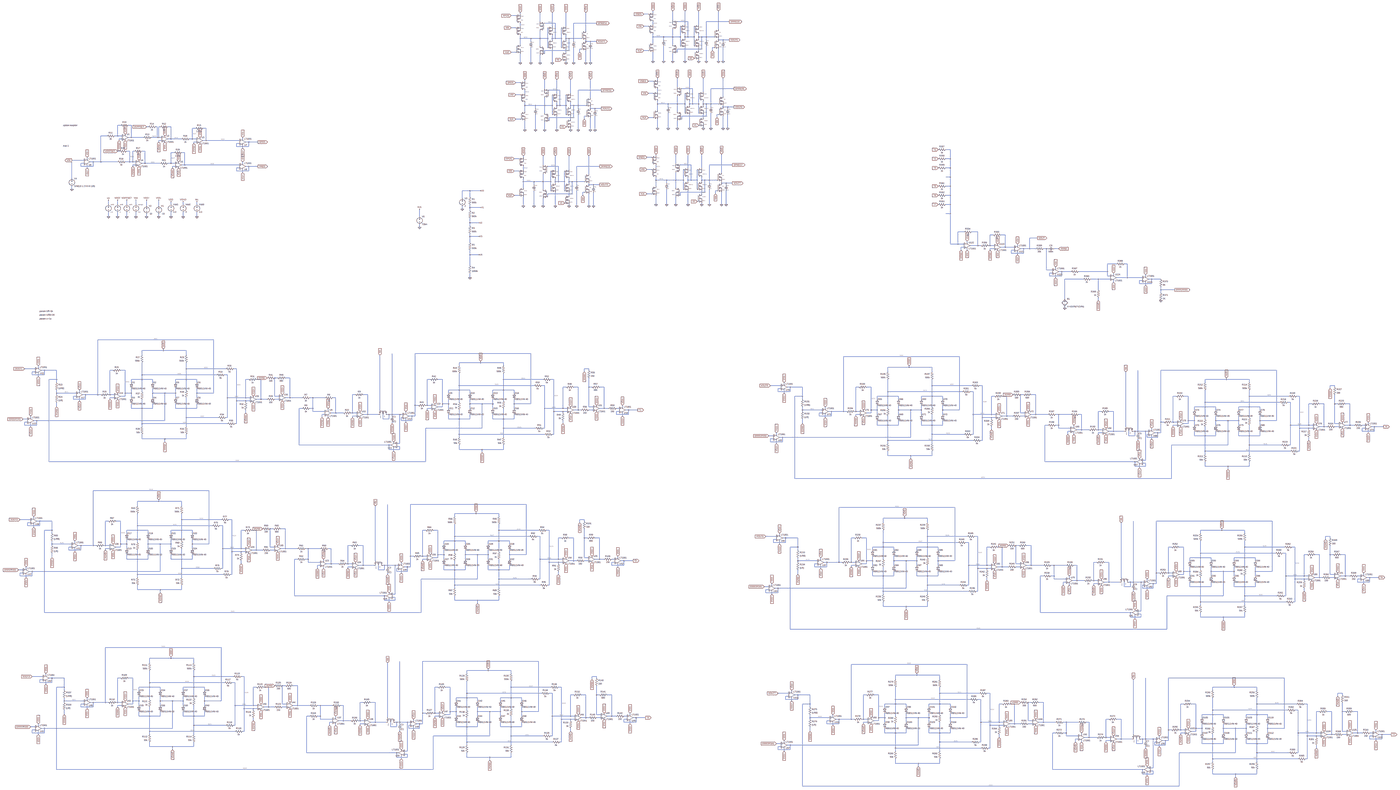
[diagram p0: schematic OZ_6_pure_curves.asc, whole sheet]
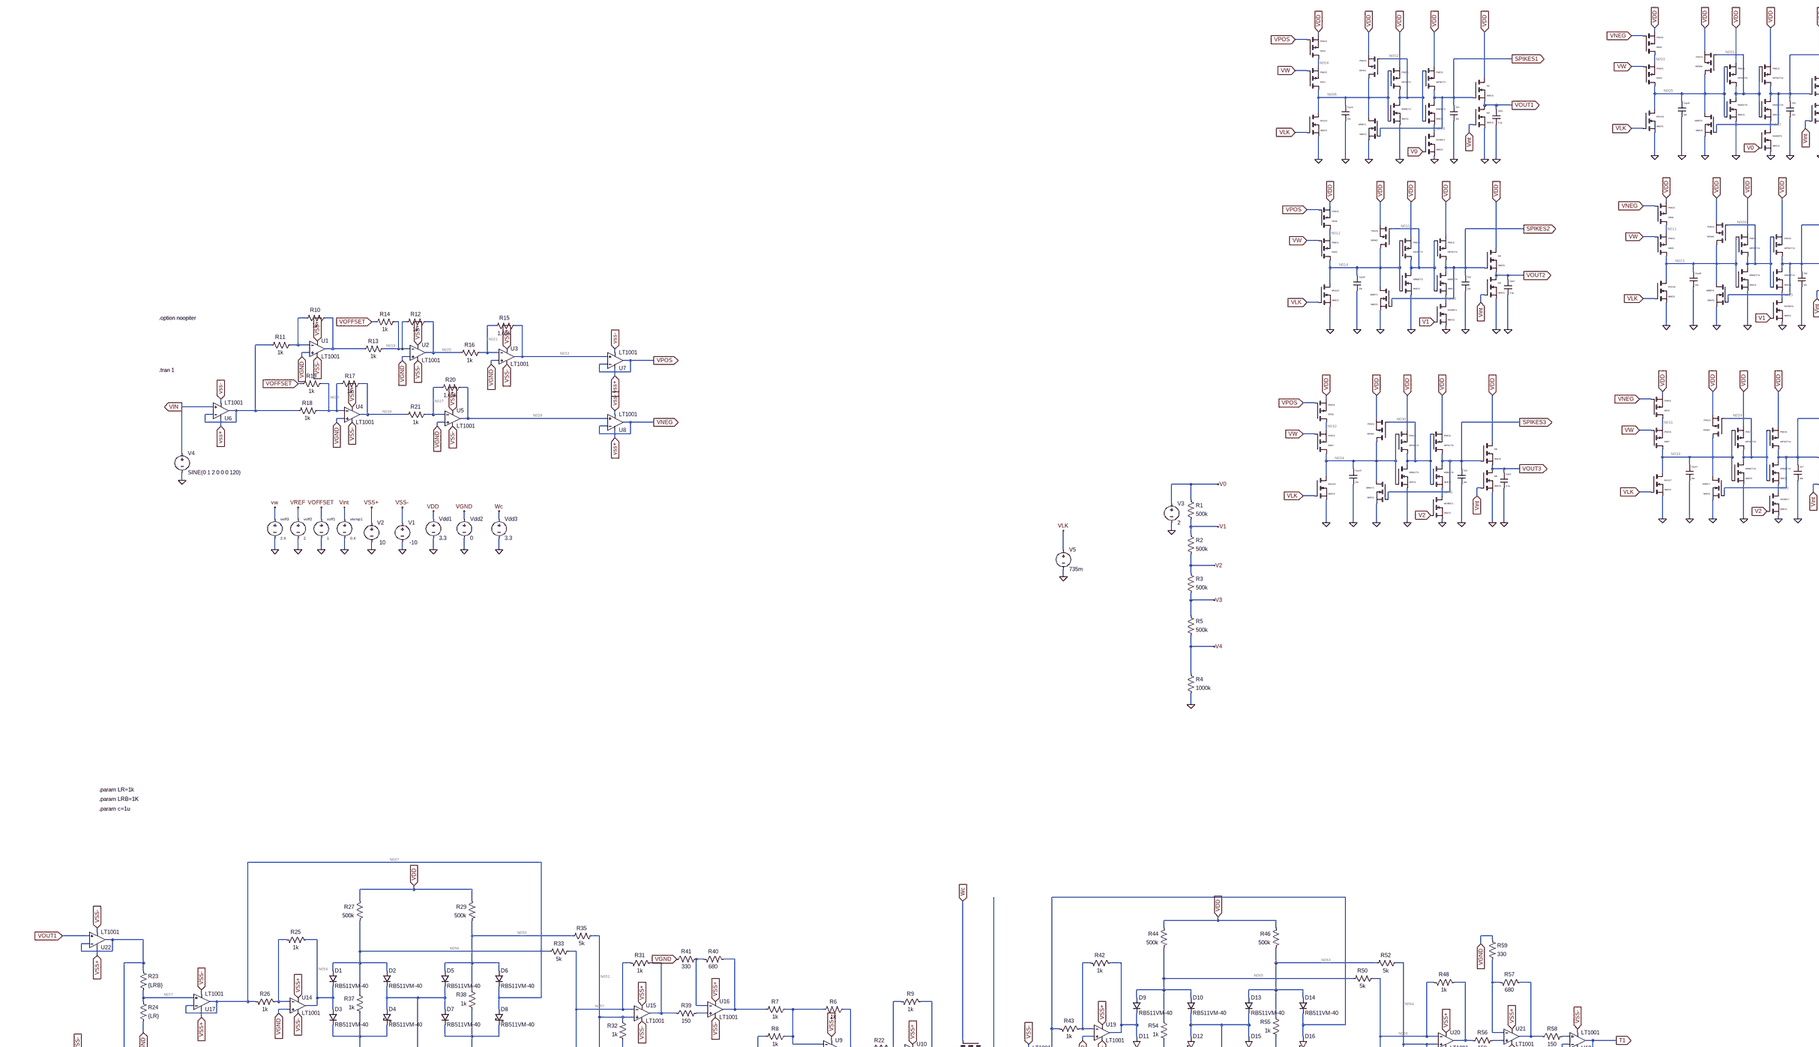
[diagram p1: schematic OZ_6_pure_curves.asc, part, row 1 of 2, column 1 of 2]
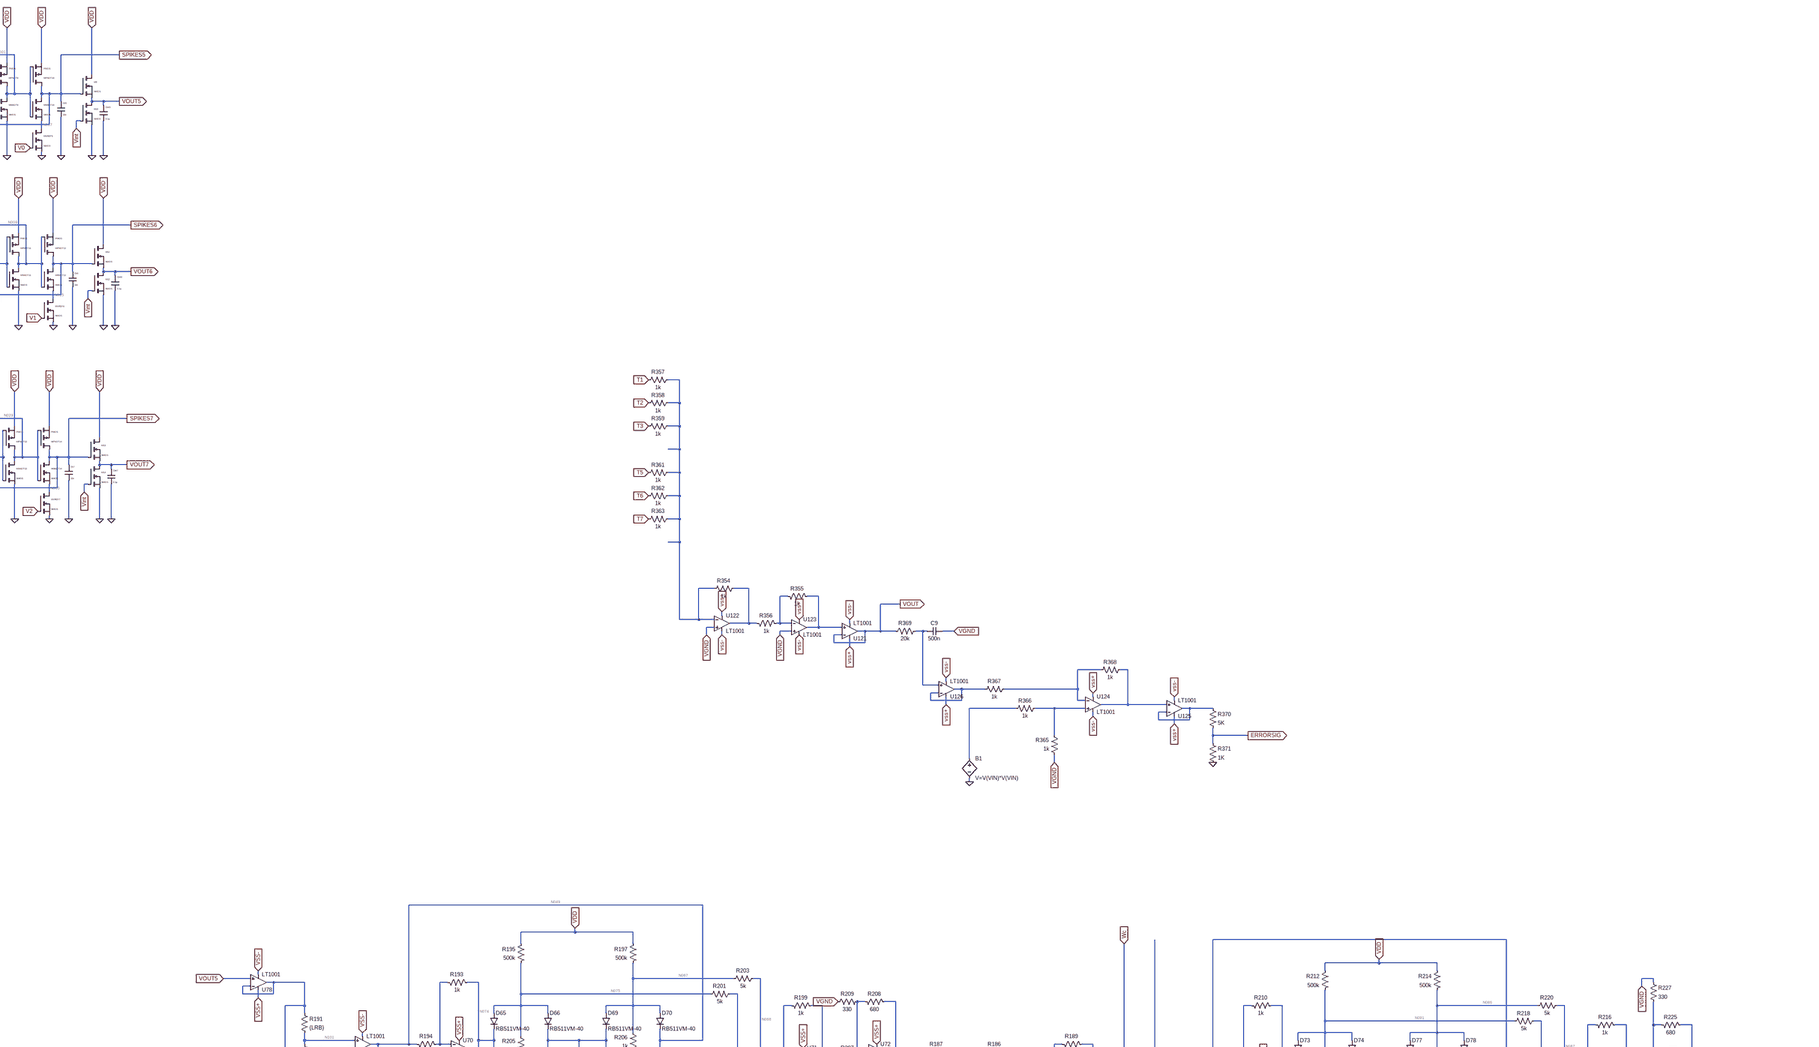
[diagram p2: schematic OZ_6_pure_curves.asc, part, row 1 of 2, column 2 of 2]
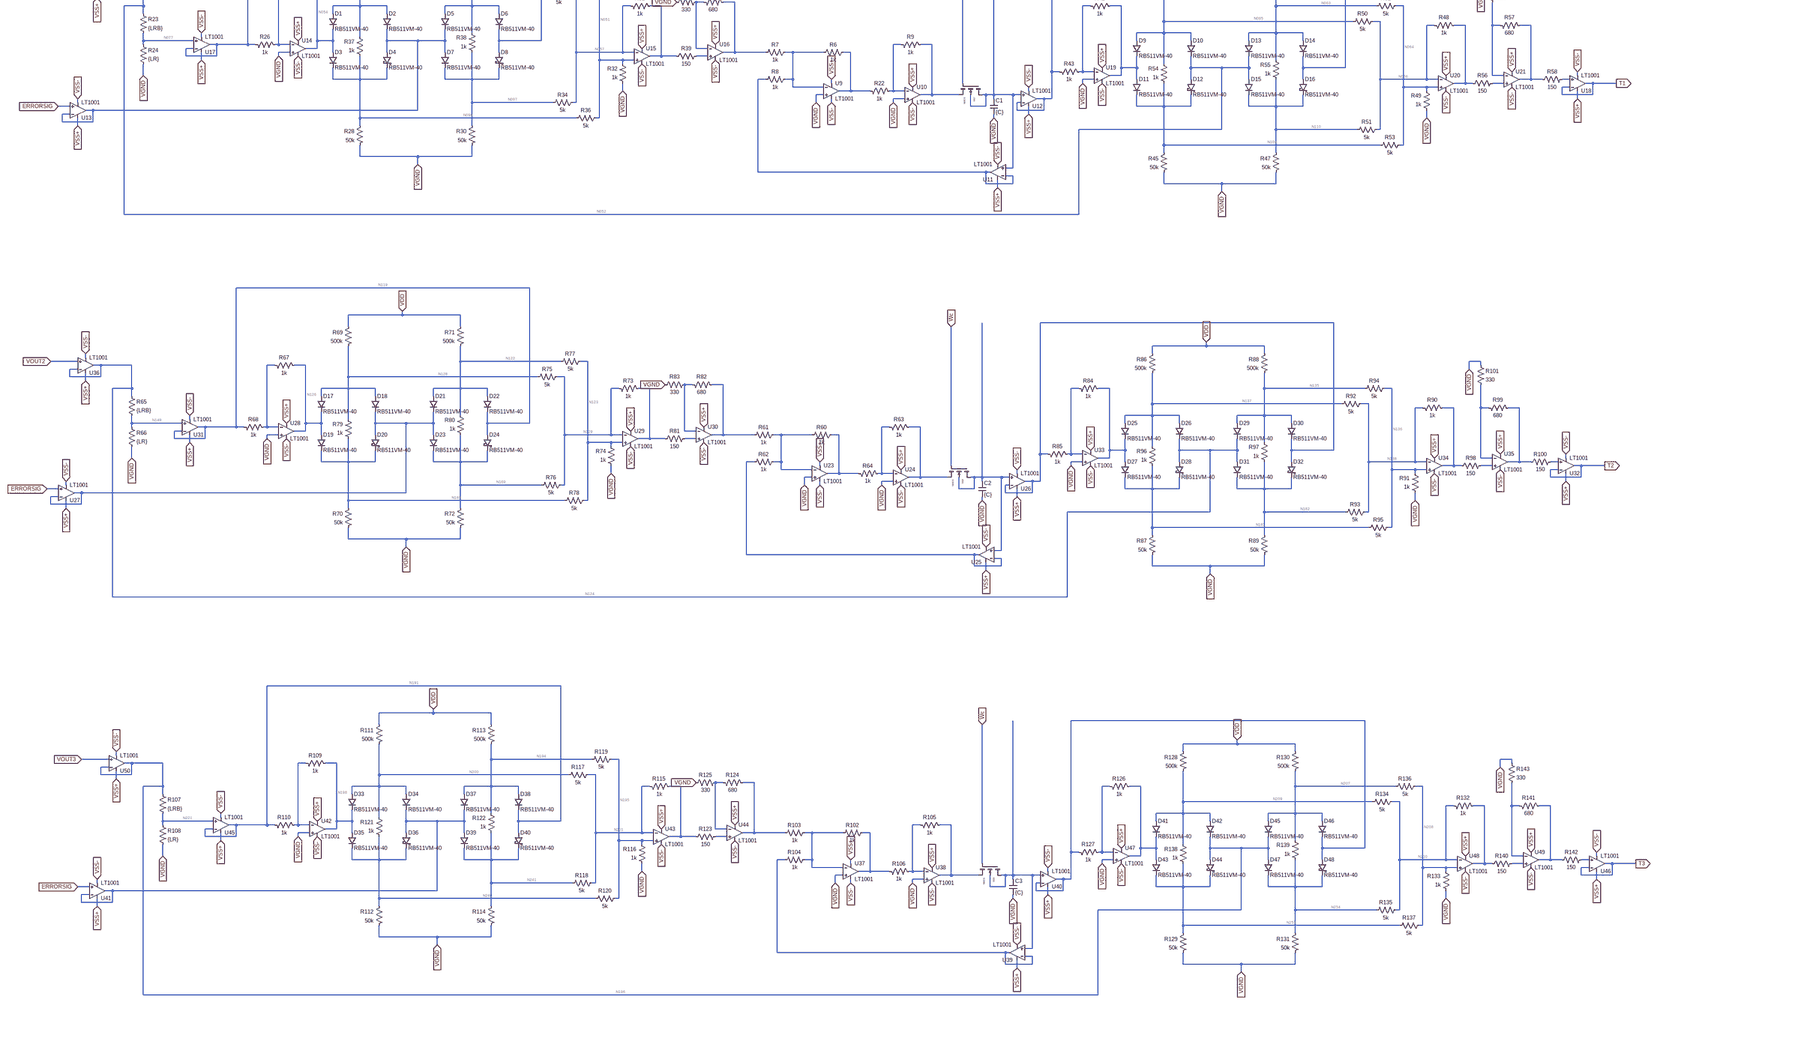
[diagram p3: schematic OZ_6_pure_curves.asc, part, row 2 of 2, column 1 of 2]
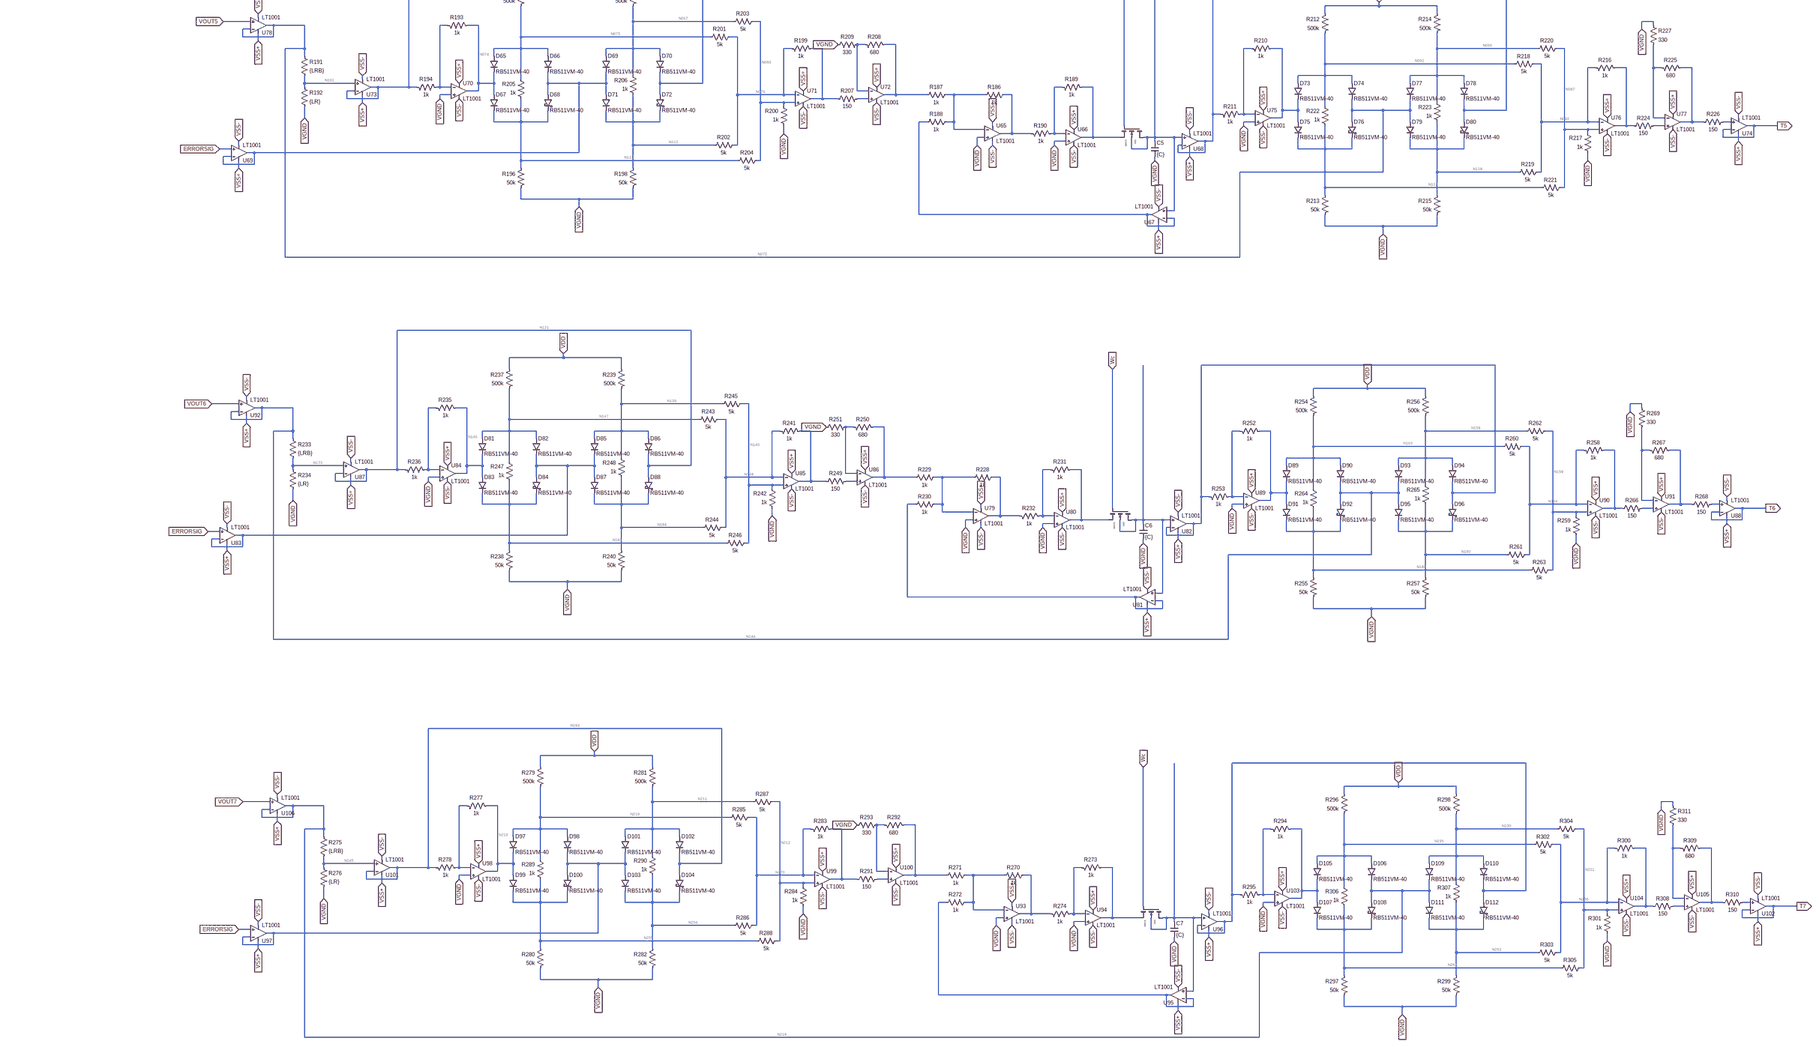
[diagram p4: schematic OZ_6_pure_curves.asc, part, row 2 of 2, column 2 of 2]
* OZ_6_pure_curves.asc
vtemp1 Vint 0 0.4
Vdd1 VDD 0 3.3
V1 VSS- 0 -10
V2 VSS+ 0 10
voff1 VOFFSET 0 1
voff2 VREF 0 2
voff3 vw 0 2.4
Vdd2 VGND 0 0
XU1 VGND N017 VSS+ VSS- N018 LT1001  ; pins In+ In- V+ V- OUT
R10 N018 N017 1k
R11 N017 N023 1k
XU2 VGND N019 VSS+ VSS- N020 LT1001  ; pins In+ In- V+ V- OUT
R12 N020 N019 1k
R13 N019 N018 1k
R14 N019 VOFFSET 1k
XU3 VGND N021 VSS+ VSS- N022 LT1001  ; pins In+ In- V+ V- OUT
R15 N022 N021 1.65k
R16 N021 N020 1k
XU4 VGND N025 VSS+ VSS- N026 LT1001  ; pins In+ In- V+ V- OUT
R17 N026 N025 1k
R18 N025 N023 1k
R19 N025 VOFFSET 1k
XU5 VGND N027 VSS+ VSS- N028 LT1001  ; pins In+ In- V+ V- OUT
R20 N028 N027 1.65k
R21 N027 N026 1k
XU6 VIN N023 VSS+ VSS- N023 LT1001  ; pins In+ In- V+ V- OUT
XU7 N022 VPOS VSS+ VSS- VPOS LT1001  ; pins In+ In- V+ V- OUT
XU8 N028 VNEG VSS+ VSS- VNEG LT1001  ; pins In+ In- V+ V- OUT
V4 VIN 0 SINE(0 1 2 0 0 0 120)
XU121 N039 VOUT VSS+ VSS- VOUT LT1001  ; pins In+ In- V+ V- OUT
XU122 VGND N024 VSS+ VSS- N037 LT1001  ; pins In+ In- V+ V- OUT
R354 N037 N024 1k
XU123 VGND N038 VSS+ VSS- N039 LT1001  ; pins In+ In- V+ V- OUT
R355 N038 N039 1k
R356 N037 N038 1k
R357 N024 T1 1k
R358 N024 T2 1k
R359 N024 T3 1k
R361 N024 T5 1k
R362 N024 T6 1k
R363 N024 T7 1k
M17 N105 Wc N080 N105 NMOS
C1 N105 VGND {C} IC=0
XU9 VGND N088 VSS+ VSS- N089 LT1001  ; pins In+ In- V+ V- OUT
R6 N089 N088 1k
R7 N088 N059 1k
R8 N088 N098 1k
XU10 VGND N079 VSS+ VSS- N080 LT1001  ; pins In+ In- V+ V- OUT
R9 N079 N080 1k
R22 N089 N079 1k
XU11 N105 N098 VSS+ VSS- N098 LT1001  ; pins In+ In- V+ V- OUT
XU12 N105 N048 VSS+ VSS- N048 LT1001  ; pins In+ In- V+ V- OUT
R23 N052 N077 {LRB}
R24 N077 VGND {LR}
XU13 ERRORSIG N078 VSS+ VSS- N078 LT1001  ; pins In+ In- V+ V- OUT
D1 N056 N054 RB511VM-40
XU14 VGND N053 VSS+ VSS- N054 LT1001  ; pins In+ In- V+ V- OUT
R25 N053 N054 1k
R26 N047 N053 1k
D2 N056 N078 RB511VM-40
D3 N054 N096 RB511VM-40
D4 N078 N096 RB511VM-40
R27 VDD N056 500k
R28 N096 VGND 50k
D5 N050 N078 RB511VM-40
D6 N050 N047 RB511VM-40
D7 N078 N097 RB511VM-40
D8 N047 N097 RB511VM-40
R29 VDD N050 500k
R30 N097 VGND 50k
XU15 N051 N057 VSS+ VSS- N060 LT1001  ; pins In+ In- V+ V- OUT
R31 N057 N060 1k
R32 VGND N051 1k
R33 N057 N056 5k
R34 N057 N097 5k
R35 N051 N050 5k
R36 N051 N096 5k
R37 N096 N056 1k
R38 N097 N050 1k
R39 N060 N090 150
XU16 N090 N058 VSS+ VSS- N059 LT1001  ; pins In+ In- V+ V- OUT
R40 N058 N059 680
R41 VGND N058 330
XU17 N077 N047 VSS+ VSS- N047 LT1001  ; pins In+ In- V+ V- OUT
XU18 N099 T1 VSS+ VSS- T1 LT1001  ; pins In+ In- V+ V- OUT
D9 N065 N062 RB511VM-40
XU19 VGND N061 VSS+ VSS- N062 LT1001  ; pins In+ In- V+ V- OUT
R42 N061 N062 1k
R43 N048 N061 1k
D10 N065 N052 RB511VM-40
D11 N062 N109 RB511VM-40
D12 N052 N109 RB511VM-40
R44 VDD N065 500k
R45 N109 VGND 50k
D13 N063 N052 RB511VM-40
D14 N063 N048 RB511VM-40
D15 N052 N110 RB511VM-40
D16 N048 N110 RB511VM-40
R46 VDD N063 500k
R47 N110 VGND 50k
XU20 N064 N066 VSS+ VSS- N069 LT1001  ; pins In+ In- V+ V- OUT
R48 N066 N069 1k
R49 VGND N064 1k
R50 N066 N065 5k
R51 N066 N110 5k
R52 N064 N063 5k
R53 N064 N109 5k
R54 N109 N065 1k
R55 N110 N063 1k
R56 N069 N100 150
XU21 N100 N070 VSS+ VSS- N071 LT1001  ; pins In+ In- V+ V- OUT
R57 N070 N071 680
R58 N071 N099 150
R59 VGND N070 330
XU22 VOUT1 N052 VSS+ VSS- N052 LT1001  ; pins In+ In- V+ V- OUT
M18 N177 Wc N152 N177 NMOS
C2 N177 VGND {C} IC=0
XU23 VGND N160 VSS+ VSS- N161 LT1001  ; pins In+ In- V+ V- OUT
R60 N161 N160 1k
R61 N160 N131 1k
R62 N160 N170 1k
XU24 VGND N151 VSS+ VSS- N152 LT1001  ; pins In+ In- V+ V- OUT
R63 N151 N152 1k
R64 N161 N151 1k
XU25 N177 N170 VSS+ VSS- N170 LT1001  ; pins In+ In- V+ V- OUT
XU26 N177 N120 VSS+ VSS- N120 LT1001  ; pins In+ In- V+ V- OUT
R65 N124 N149 {LRB}
R66 N149 VGND {LR}
XU27 ERRORSIG N150 VSS+ VSS- N150 LT1001  ; pins In+ In- V+ V- OUT
D17 N128 N126 RB511VM-40
XU28 VGND N125 VSS+ VSS- N126 LT1001  ; pins In+ In- V+ V- OUT
R67 N125 N126 1k
R68 N119 N125 1k
D18 N128 N150 RB511VM-40
D19 N126 N168 RB511VM-40
D20 N150 N168 RB511VM-40
R69 VDD N128 500k
R70 N168 VGND 50k
D21 N122 N150 RB511VM-40
D22 N122 N119 RB511VM-40
D23 N150 N169 RB511VM-40
D24 N119 N169 RB511VM-40
R71 VDD N122 500k
R72 N169 VGND 50k
XU29 N123 N129 VSS+ VSS- N132 LT1001  ; pins In+ In- V+ V- OUT
R73 N129 N132 1k
R74 VGND N123 1k
R75 N129 N128 5k
R76 N129 N169 5k
R77 N123 N122 5k
R78 N123 N168 5k
R79 N168 N128 1k
R80 N169 N122 1k
R81 N132 N162 150
XU30 N162 N130 VSS+ VSS- N131 LT1001  ; pins In+ In- V+ V- OUT
R82 N130 N131 680
R83 VGND N130 330
XU31 N149 N119 VSS+ VSS- N119 LT1001  ; pins In+ In- V+ V- OUT
XU32 N171 T2 VSS+ VSS- T2 LT1001  ; pins In+ In- V+ V- OUT
D25 N137 N134 RB511VM-40
XU33 VGND N133 VSS+ VSS- N134 LT1001  ; pins In+ In- V+ V- OUT
R84 N133 N134 1k
R85 N120 N133 1k
D26 N137 N124 RB511VM-40
D27 N134 N181 RB511VM-40
D28 N124 N181 RB511VM-40
R86 VDD N137 500k
R87 N181 VGND 50k
D29 N135 N124 RB511VM-40
D30 N135 N120 RB511VM-40
D31 N124 N182 RB511VM-40
D32 N120 N182 RB511VM-40
R88 VDD N135 500k
R89 N182 VGND 50k
XU34 N136 N138 VSS+ VSS- N141 LT1001  ; pins In+ In- V+ V- OUT
R90 N138 N141 1k
R91 VGND N136 1k
R92 N138 N137 5k
R93 N138 N182 5k
R94 N136 N135 5k
R95 N136 N181 5k
R96 N181 N137 1k
R97 N182 N135 1k
R98 N141 N172 150
XU35 N172 N142 VSS+ VSS- N143 LT1001  ; pins In+ In- V+ V- OUT
R99 N142 N143 680
R100 N143 N171 150
R101 VGND N142 330
XU36 VOUT2 N124 VSS+ VSS- N124 LT1001  ; pins In+ In- V+ V- OUT
M19 N249 Wc N224 N249 NMOS
C3 N249 VGND {C} IC=0
XU37 VGND N232 VSS+ VSS- N233 LT1001  ; pins In+ In- V+ V- OUT
R102 N233 N232 1k
R103 N232 N203 1k
R104 N232 N242 1k
XU38 VGND N223 VSS+ VSS- N224 LT1001  ; pins In+ In- V+ V- OUT
R105 N223 N224 1k
R106 N233 N223 1k
XU39 N249 N242 VSS+ VSS- N242 LT1001  ; pins In+ In- V+ V- OUT
XU40 N249 N192 VSS+ VSS- N192 LT1001  ; pins In+ In- V+ V- OUT
R107 N196 N221 {LRB}
R108 N221 VGND {LR}
XU41 ERRORSIG N222 VSS+ VSS- N222 LT1001  ; pins In+ In- V+ V- OUT
D33 N200 N198 RB511VM-40
XU42 VGND N197 VSS+ VSS- N198 LT1001  ; pins In+ In- V+ V- OUT
R109 N197 N198 1k
R110 N191 N197 1k
D34 N200 N222 RB511VM-40
D35 N198 N240 RB511VM-40
D36 N222 N240 RB511VM-40
R111 VDD N200 500k
R112 N240 VGND 50k
D37 N194 N222 RB511VM-40
D38 N194 N191 RB511VM-40
D39 N222 N241 RB511VM-40
D40 N191 N241 RB511VM-40
R113 VDD N194 500k
R114 N241 VGND 50k
XU43 N195 N201 VSS+ VSS- N204 LT1001  ; pins In+ In- V+ V- OUT
R115 N201 N204 1k
R116 VGND N195 1k
R117 N201 N200 5k
R118 N201 N241 5k
R119 N195 N194 5k
R120 N195 N240 5k
R121 N240 N200 1k
R122 N241 N194 1k
R123 N204 N234 150
XU44 N234 N202 VSS+ VSS- N203 LT1001  ; pins In+ In- V+ V- OUT
R124 N202 N203 680
R125 VGND N202 330
XU45 N221 N191 VSS+ VSS- N191 LT1001  ; pins In+ In- V+ V- OUT
XU46 N243 T3 VSS+ VSS- T3 LT1001  ; pins In+ In- V+ V- OUT
D41 N209 N206 RB511VM-40
XU47 VGND N205 VSS+ VSS- N206 LT1001  ; pins In+ In- V+ V- OUT
R126 N205 N206 1k
R127 N192 N205 1k
D42 N209 N196 RB511VM-40
D43 N206 N253 RB511VM-40
D44 N196 N253 RB511VM-40
R128 VDD N209 500k
R129 N253 VGND 50k
D45 N207 N196 RB511VM-40
D46 N207 N192 RB511VM-40
D47 N196 N254 RB511VM-40
D48 N192 N254 RB511VM-40
R130 VDD N207 500k
R131 N254 VGND 50k
XU48 N208 N210 VSS+ VSS- N213 LT1001  ; pins In+ In- V+ V- OUT
R132 N210 N213 1k
R133 VGND N208 1k
R134 N210 N209 5k
R135 N210 N254 5k
R136 N208 N207 5k
R137 N208 N253 5k
R138 N253 N209 1k
R139 N254 N207 1k
R140 N213 N244 150
XU49 N244 N214 VSS+ VSS- N215 LT1001  ; pins In+ In- V+ V- OUT
R141 N214 N215 680
R142 N215 N243 150
R143 VGND N214 330
XU50 VOUT3 N196 VSS+ VSS- N196 LT1001  ; pins In+ In- V+ V- OUT
M21 N116 Wc N104 N116 NMOS
C5 N116 VGND {C} IC=0
XU65 VGND N106 VSS+ VSS- N107 LT1001  ; pins In+ In- V+ V- OUT
R186 N107 N106 1k
R187 N106 N082 1k
R188 N106 N113 1k
XU66 VGND N103 VSS+ VSS- N104 LT1001  ; pins In+ In- V+ V- OUT
R189 N103 N104 1k
R190 N107 N103 1k
XU67 N116 N113 VSS+ VSS- N113 LT1001  ; pins In+ In- V+ V- OUT
XU68 N116 N055 VSS+ VSS- N055 LT1001  ; pins In+ In- V+ V- OUT
R191 N072 N101 {LRB}
R192 N101 VGND {LR}
XU69 ERRORSIG N102 VSS+ VSS- N102 LT1001  ; pins In+ In- V+ V- OUT
D65 N075 N074 RB511VM-40
XU70 VGND N073 VSS+ VSS- N074 LT1001  ; pins In+ In- V+ V- OUT
R193 N073 N074 1k
R194 N049 N073 1k
D66 N075 N102 RB511VM-40
D67 N074 N111 RB511VM-40
D68 N102 N111 RB511VM-40
R195 VDD N075 500k
R196 N111 VGND 50k
D69 N067 N102 RB511VM-40
D70 N067 N049 RB511VM-40
D71 N102 N112 RB511VM-40
D72 N049 N112 RB511VM-40
R197 VDD N067 500k
R198 N112 VGND 50k
XU71 N068 N076 VSS+ VSS- N083 LT1001  ; pins In+ In- V+ V- OUT
R199 N076 N083 1k
R200 VGND N068 1k
R201 N076 N075 5k
R202 N076 N112 5k
R203 N068 N067 5k
R204 N068 N111 5k
R205 N111 N075 1k
R206 N112 N067 1k
R207 N083 N108 150
XU72 N108 N081 VSS+ VSS- N082 LT1001  ; pins In+ In- V+ V- OUT
R208 N081 N082 680
R209 VGND N081 330
XU73 N101 N049 VSS+ VSS- N049 LT1001  ; pins In+ In- V+ V- OUT
XU74 N114 T5 VSS+ VSS- T5 LT1001  ; pins In+ In- V+ V- OUT
D73 N091 N085 RB511VM-40
XU75 VGND N084 VSS+ VSS- N085 LT1001  ; pins In+ In- V+ V- OUT
R210 N084 N085 1k
R211 N055 N084 1k
D74 N091 N072 RB511VM-40
D75 N085 N117 RB511VM-40
D76 N072 N117 RB511VM-40
R212 VDD N091 500k
R213 N117 VGND 50k
D77 N086 N072 RB511VM-40
D78 N086 N055 RB511VM-40
D79 N072 N118 RB511VM-40
D80 N055 N118 RB511VM-40
R214 VDD N086 500k
R215 N118 VGND 50k
XU76 N087 N092 VSS+ VSS- N093 LT1001  ; pins In+ In- V+ V- OUT
R216 N092 N093 1k
R217 VGND N087 1k
R218 N092 N091 5k
R219 N092 N118 5k
R220 N087 N086 5k
R221 N087 N117 5k
R222 N117 N091 1k
R223 N118 N086 1k
R224 N093 N115 150
XU77 N115 N094 VSS+ VSS- N095 LT1001  ; pins In+ In- V+ V- OUT
R225 N094 N095 680
R226 N095 N114 150
R227 VGND N094 330
XU78 VOUT5 N072 VSS+ VSS- N072 LT1001  ; pins In+ In- V+ V- OUT
M22 N188 Wc N176 N188 NMOS
C6 N188 VGND {C} IC=0
XU79 VGND N178 VSS+ VSS- N179 LT1001  ; pins In+ In- V+ V- OUT
R228 N179 N178 1k
R229 N178 N154 1k
R230 N178 N185 1k
XU80 VGND N175 VSS+ VSS- N176 LT1001  ; pins In+ In- V+ V- OUT
R231 N175 N176 1k
R232 N179 N175 1k
XU81 N188 N185 VSS+ VSS- N185 LT1001  ; pins In+ In- V+ V- OUT
XU82 N188 N127 VSS+ VSS- N127 LT1001  ; pins In+ In- V+ V- OUT
R233 N144 N173 {LRB}
R234 N173 VGND {LR}
XU83 ERRORSIG N174 VSS+ VSS- N174 LT1001  ; pins In+ In- V+ V- OUT
D81 N147 N146 RB511VM-40
XU84 VGND N145 VSS+ VSS- N146 LT1001  ; pins In+ In- V+ V- OUT
R235 N145 N146 1k
R236 N121 N145 1k
D82 N147 N174 RB511VM-40
D83 N146 N183 RB511VM-40
D84 N174 N183 RB511VM-40
R237 VDD N147 500k
R238 N183 VGND 50k
D85 N139 N174 RB511VM-40
D86 N139 N121 RB511VM-40
D87 N174 N184 RB511VM-40
D88 N121 N184 RB511VM-40
R239 VDD N139 500k
R240 N184 VGND 50k
XU85 N140 N148 VSS+ VSS- N155 LT1001  ; pins In+ In- V+ V- OUT
R241 N148 N155 1k
R242 VGND N140 1k
R243 N148 N147 5k
R244 N148 N184 5k
R245 N140 N139 5k
R246 N140 N183 5k
R247 N183 N147 1k
R248 N184 N139 1k
R249 N155 N180 150
XU86 N180 N153 VSS+ VSS- N154 LT1001  ; pins In+ In- V+ V- OUT
R250 N153 N154 680
R251 VGND N153 330
XU87 N173 N121 VSS+ VSS- N121 LT1001  ; pins In+ In- V+ V- OUT
XU88 N186 T6 VSS+ VSS- T6 LT1001  ; pins In+ In- V+ V- OUT
D89 N163 N157 RB511VM-40
XU89 VGND N156 VSS+ VSS- N157 LT1001  ; pins In+ In- V+ V- OUT
R252 N156 N157 1k
R253 N127 N156 1k
D90 N163 N144 RB511VM-40
D91 N157 N189 RB511VM-40
D92 N144 N189 RB511VM-40
R254 VDD N163 500k
R255 N189 VGND 50k
D93 N158 N144 RB511VM-40
D94 N158 N127 RB511VM-40
D95 N144 N190 RB511VM-40
D96 N127 N190 RB511VM-40
R256 VDD N158 500k
R257 N190 VGND 50k
XU90 N159 N164 VSS+ VSS- N165 LT1001  ; pins In+ In- V+ V- OUT
R258 N164 N165 1k
R259 VGND N159 1k
R260 N164 N163 5k
R261 N164 N190 5k
R262 N159 N158 5k
R263 N159 N189 5k
R264 N189 N163 1k
R265 N190 N158 1k
R266 N165 N187 150
XU91 N187 N166 VSS+ VSS- N167 LT1001  ; pins In+ In- V+ V- OUT
R267 N166 N167 680
R268 N167 N186 150
R269 VGND N166 330
XU92 VOUT6 N144 VSS+ VSS- N144 LT1001  ; pins In+ In- V+ V- OUT
M23 N260 Wc N248 N260 NMOS
C7 N260 VGND {C} IC=0
XU93 VGND N250 VSS+ VSS- N251 LT1001  ; pins In+ In- V+ V- OUT
R270 N251 N250 1k
R271 N250 N226 1k
R272 N250 N257 1k
XU94 VGND N247 VSS+ VSS- N248 LT1001  ; pins In+ In- V+ V- OUT
R273 N247 N248 1k
R274 N251 N247 1k
XU95 N260 N257 VSS+ VSS- N257 LT1001  ; pins In+ In- V+ V- OUT
XU96 N260 N199 VSS+ VSS- N199 LT1001  ; pins In+ In- V+ V- OUT
R275 N216 N245 {LRB}
R276 N245 VGND {LR}
XU97 ERRORSIG N246 VSS+ VSS- N246 LT1001  ; pins In+ In- V+ V- OUT
D97 N219 N218 RB511VM-40
XU98 VGND N217 VSS+ VSS- N218 LT1001  ; pins In+ In- V+ V- OUT
R277 N217 N218 1k
R278 N193 N217 1k
D98 N219 N246 RB511VM-40
D99 N218 N255 RB511VM-40
D100 N246 N255 RB511VM-40
R279 VDD N219 500k
R280 N255 VGND 50k
D101 N211 N246 RB511VM-40
D102 N211 N193 RB511VM-40
D103 N246 N256 RB511VM-40
D104 N193 N256 RB511VM-40
R281 VDD N211 500k
R282 N256 VGND 50k
XU99 N212 N220 VSS+ VSS- N227 LT1001  ; pins In+ In- V+ V- OUT
R283 N220 N227 1k
R284 VGND N212 1k
R285 N220 N219 5k
R286 N220 N256 5k
R287 N212 N211 5k
R288 N212 N255 5k
R289 N255 N219 1k
R290 N256 N211 1k
R291 N227 N252 150
XU100 N252 N225 VSS+ VSS- N226 LT1001  ; pins In+ In- V+ V- OUT
R292 N225 N226 680
R293 VGND N225 330
XU101 N245 N193 VSS+ VSS- N193 LT1001  ; pins In+ In- V+ V- OUT
XU102 N258 T7 VSS+ VSS- T7 LT1001  ; pins In+ In- V+ V- OUT
D105 N235 N229 RB511VM-40
XU103 VGND N228 VSS+ VSS- N229 LT1001  ; pins In+ In- V+ V- OUT
R294 N228 N229 1k
R295 N199 N228 1k
D106 N235 N216 RB511VM-40
D107 N229 N261 RB511VM-40
D108 N216 N261 RB511VM-40
R296 VDD N235 500k
R297 N261 VGND 50k
D109 N230 N216 RB511VM-40
D110 N230 N199 RB511VM-40
D111 N216 N262 RB511VM-40
D112 N199 N262 RB511VM-40
R298 VDD N230 500k
R299 N262 VGND 50k
XU104 N231 N236 VSS+ VSS- N237 LT1001  ; pins In+ In- V+ V- OUT
R300 N236 N237 1k
R301 VGND N231 1k
R302 N236 N235 5k
R303 N236 N262 5k
R304 N231 N230 5k
R305 N231 N261 5k
R306 N261 N235 1k
R307 N262 N230 1k
R308 N237 N259 150
XU105 N259 N238 VSS+ VSS- N239 LT1001  ; pins In+ In- V+ V- OUT
R309 N238 N239 680
R310 N239 N258 150
R311 VGND N238 330
XU106 VOUT7 N216 VSS+ VSS- N216 LT1001  ; pins In+ In- V+ V- OUT
XU124 N045 N041 VSS+ VSS- N042 LT1001  ; pins In+ In- V+ V- OUT
R365 VGND N045 1k
R366 N045 N044 1k
R367 N041 N043 1k
R368 N042 N041 1k
XU125 N042 N046 VSS+ VSS- N046 LT1001  ; pins In+ In- V+ V- OUT
R369 VOUT N040 20k
C9 N040 VGND 500n
XU126 N040 N043 VSS+ VSS- N043 LT1001  ; pins In+ In- V+ V- OUT
R370 N046 ERRORSIG 5K
R371 ERRORSIG 0 1K
Vdd3 Wc 0 3.3
MW1 N006 vw N004 N004 PMOS
Csyn1 N006 0 10n V=4 Irms=162m Rser=0.395426 Lser=0 mfg="KEMET" pn="C0402C103K7PAC" type="X5R" IC=0
Ck1 SPIKES1 0 10n
MPNOT1 N002 N006 VDD VDD PMOS
MNNOT1 N002 N006 0 0 NMOS
MVREF1 N008 V0 0 0 NMOS
MREF1 N006 SPIKES1 0 0 NMOS
MVLK1 N006 VLK 0 0 NMOS
MINA1 N006 N002 VDD VDD PMOS
MIN1 N004 VPOS VDD VDD PMOS
MPNOT2 SPIKES1 N002 VDD VDD PMOS
MNNOT2 SPIKES1 N002 N008 N008 NMOS
M1 VDD SPIKES1 VOUT1 VOUT1 NMOS
M2 VOUT1 Vint 0 0 NMOS
Cint1 VOUT1 0 0.1µ
MW2 N014 vw N012 N012 PMOS
Csyn2 N014 0 10n V=4 Irms=162m Rser=0.395426 Lser=0 mfg="KEMET" pn="C0402C103K7PAC" type="X5R" IC=0
Ck2 SPIKES2 0 10n
MPNOT3 N010 N014 VDD VDD PMOS
MNNOT3 N010 N014 0 0 NMOS
MVREF2 N016 V1 0 0 NMOS
MREF2 N014 SPIKES2 0 0 NMOS
MVLK2 N014 VLK 0 0 NMOS
MINA2 N014 N010 VDD VDD PMOS
MIN2 N012 VPOS VDD VDD PMOS
MPNOT4 SPIKES2 N010 VDD VDD PMOS
MNNOT4 SPIKES2 N010 N016 N016 NMOS
M3 VDD SPIKES2 VOUT2 VOUT2 NMOS
M4 VOUT2 Vint 0 0 NMOS
Cint2 VOUT2 0 0.1µ
MW3 N034 vw N032 N032 PMOS
Csyn3 N034 0 10n V=4 Irms=162m Rser=0.395426 Lser=0 mfg="KEMET" pn="C0402C103K7PAC" type="X5R" IC=0
Ck3 SPIKES3 0 10n
MPNOT5 N030 N034 VDD VDD PMOS
MNNOT5 N030 N034 0 0 NMOS
MVREF3 N036 V2 0 0 NMOS
MREF3 N034 SPIKES3 0 0 NMOS
MVLK3 N034 VLK 0 0 NMOS
MINA3 N034 N030 VDD VDD PMOS
MIN3 N032 VPOS VDD VDD PMOS
MPNOT6 SPIKES3 N030 VDD VDD PMOS
MNNOT6 SPIKES3 N030 N036 N036 NMOS
M5 VDD SPIKES3 VOUT3 VOUT3 NMOS
M6 VOUT3 Vint 0 0 NMOS
Cint3 VOUT3 0 0.1µ
MW5 N005 vw N003 N003 PMOS
Csyn5 N005 0 10n V=4 Irms=162m Rser=0.395426 Lser=0 mfg="KEMET" pn="C0402C103K7PAC" type="X5R" IC=0
Ck5 SPIKES5 0 10n
MPNOT9 N001 N005 VDD VDD PMOS
MNNOT9 N001 N005 0 0 NMOS
MVREF5 N007 V0 0 0 NMOS
MREF5 N005 SPIKES5 0 0 NMOS
MVLK5 N005 VLK 0 0 NMOS
MINA5 N005 N001 VDD VDD PMOS
MIN5 N003 VNEG VDD VDD PMOS
MPNOT10 SPIKES5 N001 VDD VDD PMOS
MNNOT10 SPIKES5 N001 N007 N007 NMOS
M9 VDD SPIKES5 VOUT5 VOUT5 NMOS
M10 VOUT5 Vint 0 0 NMOS
Cint5 VOUT5 0 0.1µ
MW6 N013 vw N011 N011 PMOS
Csyn6 N013 0 10n V=4 Irms=162m Rser=0.395426 Lser=0 mfg="KEMET" pn="C0402C103K7PAC" type="X5R" IC=0
Ck6 SPIKES6 0 10n
MPNOT11 N009 N013 VDD VDD PMOS
MNNOT11 N009 N013 0 0 NMOS
MVREF6 N015 V1 0 0 NMOS
MREF6 N013 SPIKES6 0 0 NMOS
MVLK6 N013 VLK 0 0 NMOS
MINA6 N013 N009 VDD VDD PMOS
MIN6 N011 VNEG VDD VDD PMOS
MPNOT12 SPIKES6 N009 VDD VDD PMOS
MNNOT12 SPIKES6 N009 N015 N015 NMOS
M11 VDD SPIKES6 VOUT6 VOUT6 NMOS
M12 VOUT6 Vint 0 0 NMOS
Cint6 VOUT6 0 0.1µ
MW7 N033 vw N031 N031 PMOS
Csyn7 N033 0 10n V=4 Irms=162m Rser=0.395426 Lser=0 mfg="KEMET" pn="C0402C103K7PAC" type="X5R" IC=0
Ck7 SPIKES7 0 10n
MPNOT13 N029 N033 VDD VDD PMOS
MNNOT13 N029 N033 0 0 NMOS
MVREF7 N035 V2 0 0 NMOS
MREF7 N033 SPIKES7 0 0 NMOS
MVLK7 N033 VLK 0 0 NMOS
MINA7 N033 N029 VDD VDD PMOS
MIN7 N031 VNEG VDD VDD PMOS
MPNOT14 SPIKES7 N029 VDD VDD PMOS
MNNOT14 SPIKES7 N029 N035 N035 NMOS
M13 VDD SPIKES7 VOUT7 VOUT7 NMOS
M14 VOUT7 Vint 0 0 NMOS
Cint7 VOUT7 0 0.1µ
V3 V0 0 2
R1 V0 V1 500k
R2 V1 V2 500k
R3 V2 V3 500k
R4 V4 0 1000k
R5 V3 V4 500k
V5 VLK 0 735m
B1 N044 0 V=V(VIN)*V(VIN)
.model D D
.lib standard.dio
.model NMOS NMOS
.model PMOS PMOS
.lib standard.mos
.tran 1
.option noopiter
.param LR=1k
.param LRB=1K
.param c=1u
.lib LTC.lib
.backanno
.end

* Results of the author's LTspice run, read from the files saved beside the schematic
* Operating Point, zero values left out:
*   V(vint) = 400 mV
*   V(vdd) = 3.3 V
*   V(vss-) = -10 V
*   V(vss+) = 10 V
*   V(voffset) = 1 V
*   V(vref) = 2 V
*   V(vw) = 2.4 V
*   V(n019) = 1.43 µV
*   V(n020) = -1 V
*   V(n021) = -2.256 µV
*   V(n022) = 1.65 V
*   V(n025) = 1.43 µV
*   V(n026) = -1 V
*   V(n027) = -2.256 µV
*   V(n028) = 1.65 V
*   V(vpos) = 1.65 V
*   V(vneg) = 1.65 V
*   V(wc) = 3.3 V
*   V(n052) = 826.3 nV
*   V(n077) = 413.2 nV
*   V(n056) = 19.24 mV
*   V(n054) = -413.1 nV
*   V(n047) = 413.2 nV
*   V(n096) = 16.29 mV
*   V(n050) = 19.24 mV
*   V(n097) = 16.29 mV
*   V(n057) = 5.076 mV
*   V(n051) = 5.076 mV
*   V(n065) = 19.24 mV
*   V(n109) = 16.29 mV
*   V(n063) = 19.24 mV
*   V(n110) = 16.29 mV
*   V(n066) = 5.076 mV
*   V(n064) = 5.076 mV
*   V(vout1) = 826.3 nV
*   V(n124) = 826.3 nV
*   V(n149) = 413.2 nV
*   V(n128) = 19.24 mV
*   V(n126) = -413.1 nV
*   V(n119) = 413.2 nV
*   V(n168) = 16.29 mV
*   V(n122) = 19.24 mV
*   V(n169) = 16.29 mV
*   V(n129) = 5.076 mV
*   V(n123) = 5.076 mV
*   V(n137) = 19.24 mV
*   V(n181) = 16.29 mV
*   V(n135) = 19.24 mV
*   V(n182) = 16.29 mV
*   V(n138) = 5.076 mV
*   V(n136) = 5.076 mV
*   V(vout2) = 826.3 nV
*   V(n196) = 826.3 nV
*   V(n221) = 413.2 nV
*   V(n200) = 19.24 mV
*   V(n198) = -413.1 nV
*   V(n191) = 413.2 nV
*   V(n240) = 16.29 mV
*   V(n194) = 19.24 mV
*   V(n241) = 16.29 mV
*   V(n201) = 5.076 mV
*   V(n195) = 5.076 mV
*   V(n209) = 19.24 mV
*   V(n253) = 16.29 mV
*   V(n207) = 19.24 mV
*   V(n254) = 16.29 mV
*   V(n210) = 5.076 mV
*   V(n208) = 5.076 mV
*   V(vout3) = 826.3 nV
*   V(n072) = 826.3 nV
*   V(n101) = 413.2 nV
*   V(n075) = 19.24 mV
*   V(n074) = -413.1 nV
*   V(n049) = 413.2 nV
*   V(n111) = 16.29 mV
*   V(n067) = 19.24 mV
*   V(n112) = 16.29 mV
*   V(n076) = 5.076 mV
*   V(n068) = 5.076 mV
*   V(n091) = 19.24 mV
*   V(n117) = 16.29 mV
*   V(n086) = 19.24 mV
*   V(n118) = 16.29 mV
*   V(n092) = 5.076 mV
*   V(n087) = 5.076 mV
*   V(vout5) = 826.3 nV
*   V(n144) = 826.3 nV
*   V(n173) = 413.2 nV
*   V(n147) = 19.24 mV
*   V(n146) = -413.1 nV
*   V(n121) = 413.2 nV
*   V(n183) = 16.29 mV
*   V(n139) = 19.24 mV
*   V(n184) = 16.29 mV
*   V(n148) = 5.076 mV
*   V(n140) = 5.076 mV
*   V(n163) = 19.24 mV
*   V(n189) = 16.29 mV
*   V(n158) = 19.24 mV
*   V(n190) = 16.29 mV
*   V(n164) = 5.076 mV
*   V(n159) = 5.076 mV
*   V(vout6) = 826.3 nV
*   V(n216) = 826.3 nV
*   V(n245) = 413.2 nV
*   V(n219) = 19.24 mV
*   V(n218) = -413.1 nV
*   V(n193) = 413.2 nV
*   V(n255) = 16.29 mV
*   V(n211) = 19.24 mV
*   V(n256) = 16.29 mV
*   V(n220) = 5.076 mV
*   V(n212) = 5.076 mV
*   V(n235) = 19.24 mV
*   V(n261) = 16.29 mV
*   V(n230) = 19.24 mV
*   V(n262) = 16.29 mV
*   V(n236) = 5.076 mV
*   V(n231) = 5.076 mV
*   V(vout7) = 826.3 nV
*   V(n006) = 2.106 µV
*   V(n004) = 3.13 V
*   V(spikes1) = 265.4 nV
*   V(n002) = 3.3 V
*   V(n008) = 165.2 nV
*   V(v0) = 2 V
*   V(vlk) = 735 mV
*   V(n014) = 2.106 µV
*   V(n012) = 3.13 V
*   V(spikes2) = 298.5 nV
*   V(n010) = 3.3 V
*   V(n016) = 198.3 nV
*   V(v1) = 1.667 V
*   V(n034) = 2.106 µV
*   V(n032) = 3.13 V
*   V(spikes3) = 348 nV
*   V(n030) = 3.3 V
*   V(n036) = 247.9 nV
*   V(v2) = 1.333 V
*   V(n005) = 2.106 µV
*   V(n003) = 3.13 V
*   V(spikes5) = 265.4 nV
*   V(n001) = 3.3 V
*   V(n007) = 165.2 nV
*   V(n013) = 2.106 µV
*   V(n011) = 3.13 V
*   V(spikes6) = 298.5 nV
*   V(n009) = 3.3 V
*   V(n015) = 198.3 nV
*   V(n033) = 2.106 µV
*   V(n031) = 3.13 V
*   V(spikes7) = 348 nV
*   V(n029) = 3.3 V
*   V(n035) = 247.9 nV
*   V(v3) = 1 V
*   V(v4) = 666.7 mV
*   Id(Mpnot14) = -6.61 pA
*   Ib(Mpnot14) = 3.31 pA
*   Is(Mpnot14) = 3.3 pA
*   Id(Min7) = -5.326 µA
*   Is(Min7) = 5.326 µA
*   Id(Mina7) = -6.61 pA
*   Ib(Mina7) = 3.31 pA
*   Is(Mina7) = 3.3 pA
*   Id(Mpnot13) = -6.61 pA
*   Is(Mpnot13) = 6.61 pA
*   Id(Mw7) = -5.326 µA
*   Ib(Mw7) = 3.14 pA
*   Is(Mw7) = 5.326 µA
*   Id(Mpnot12) = -6.61 pA
*   Ib(Mpnot12) = 3.31 pA
*   Is(Mpnot12) = 3.3 pA
*   Id(Min6) = -5.326 µA
*   Is(Min6) = 5.326 µA
*   Id(Mina6) = -6.61 pA
*   Ib(Mina6) = 3.31 pA
*   Is(Mina6) = 3.3 pA
*   Id(Mpnot11) = -6.61 pA
*   Is(Mpnot11) = 6.61 pA
*   Id(Mw6) = -5.326 µA
*   Ib(Mw6) = 3.14 pA
*   Is(Mw6) = 5.326 µA
*   Id(Mpnot10) = -6.61 pA
*   Ib(Mpnot10) = 3.31 pA
*   Is(Mpnot10) = 3.3 pA
*   Id(Min5) = -5.326 µA
*   Is(Min5) = 5.326 µA
*   Id(Mina5) = -6.61 pA
*   Ib(Mina5) = 3.31 pA
*   Is(Mina5) = 3.3 pA
*   Id(Mpnot9) = -6.61 pA
*   Is(Mpnot9) = 6.61 pA
*   Id(Mw5) = -5.326 µA
*   Ib(Mw5) = 3.14 pA
*   Is(Mw5) = 5.326 µA
*   Id(Mpnot6) = -6.61 pA
*   Ib(Mpnot6) = 3.31 pA
*   Is(Mpnot6) = 3.3 pA
*   Id(Min3) = -5.326 µA
*   Is(Min3) = 5.326 µA
*   Id(Mina3) = -6.61 pA
*   Ib(Mina3) = 3.31 pA
*   Is(Mina3) = 3.3 pA
*   Id(Mpnot5) = -6.61 pA
*   Is(Mpnot5) = 6.61 pA
*   Id(Mw3) = -5.326 µA
*   Ib(Mw3) = 3.14 pA
*   Is(Mw3) = 5.326 µA
*   Id(Mpnot4) = -6.61 pA
*   Ib(Mpnot4) = 3.31 pA
*   Is(Mpnot4) = 3.3 pA
*   Id(Min2) = -5.326 µA
*   Is(Min2) = 5.326 µA
*   Id(Mina2) = -6.61 pA
*   Ib(Mina2) = 3.31 pA
*   Is(Mina2) = 3.3 pA
*   Id(Mpnot3) = -6.61 pA
*   Is(Mpnot3) = 6.61 pA
*   Id(Mw2) = -5.326 µA
*   Ib(Mw2) = 3.14 pA
*   Is(Mw2) = 5.326 µA
*   Id(Mpnot2) = -6.61 pA
*   Ib(Mpnot2) = 3.31 pA
*   Is(Mpnot2) = 3.3 pA
*   Id(Min1) = -5.326 µA
*   Is(Min1) = 5.326 µA
*   Id(Mina1) = -6.61 pA
*   Ib(Mina1) = 3.31 pA
*   Is(Mina1) = 3.3 pA
*   Id(Mpnot1) = -6.61 pA
*   Is(Mpnot1) = 6.61 pA
*   Id(Mw1) = -5.326 µA
*   Ib(Mw1) = 3.14 pA
*   Is(Mw1) = 5.326 µA
*   Id(M14) = 6.61 pA
*   Is(M14) = -6.61 pA
*   Id(M13) = 6.61 pA
*   Ib(M13) = -3.31 pA
*   Is(M13) = -3.3 pA
*   Id(Mnnot14) = 6.61 pA
*   Is(Mnnot14) = -6.61 pA
*   Id(Mvlk7) = 30.96 pA
*   Is(Mvlk7) = -30.96 pA
*   Id(Mvref7) = 6.61 pA
*   Is(Mvref7) = -6.61 pA
*   Id(Mnnot13) = 6.61 pA
*   Ib(Mnnot13) = -3.31 pA
*   Is(Mnnot13) = -3.3 pA
*   Id(M12) = 6.61 pA
*   Is(M12) = -6.61 pA
*   Id(M11) = 6.61 pA
*   Ib(M11) = -3.31 pA
*   Is(M11) = -3.3 pA
*   Id(Mnnot12) = 6.61 pA
*   Is(Mnnot12) = -6.61 pA
*   Id(Mvlk6) = 30.96 pA
*   Is(Mvlk6) = -30.96 pA
*   Id(Mvref6) = 6.61 pA
*   Is(Mvref6) = -6.61 pA
*   Id(Mnnot11) = 6.61 pA
*   Ib(Mnnot11) = -3.31 pA
*   Is(Mnnot11) = -3.3 pA
*   Id(M10) = 6.61 pA
*   Is(M10) = -6.61 pA
*   Id(M9) = 6.61 pA
*   Ib(M9) = -3.31 pA
*   Is(M9) = -3.3 pA
*   Id(Mnnot10) = 6.61 pA
*   Is(Mnnot10) = -6.61 pA
*   Id(Mvlk5) = 30.96 pA
*   Is(Mvlk5) = -30.96 pA
*   Id(Mvref5) = 6.61 pA
*   Is(Mvref5) = -6.61 pA
*   Id(Mnnot9) = 6.61 pA
*   Ib(Mnnot9) = -3.31 pA
*   Is(Mnnot9) = -3.3 pA
*   Id(M6) = 6.61 pA
*   Is(M6) = -6.61 pA
*   Id(M5) = 6.61 pA
*   Ib(M5) = -3.31 pA
*   Is(M5) = -3.3 pA
*   Id(Mnnot6) = 6.61 pA
*   Is(Mnnot6) = -6.61 pA
*   Id(Mvlk3) = 30.96 pA
*   Is(Mvlk3) = -30.96 pA
*   Id(Mvref3) = 6.61 pA
*   Is(Mvref3) = -6.61 pA
*   Id(Mnnot5) = 6.61 pA
*   Ib(Mnnot5) = -3.31 pA
*   Is(Mnnot5) = -3.3 pA
*   Id(M4) = 6.61 pA
*   Is(M4) = -6.61 pA
*   Id(M3) = 6.61 pA
*   Ib(M3) = -3.31 pA
*   Is(M3) = -3.3 pA
*   Id(Mnnot4) = 6.61 pA
*   Is(Mnnot4) = -6.61 pA
*   Id(Mvlk2) = 30.96 pA
*   Is(Mvlk2) = -30.96 pA
*   Id(Mvref2) = 6.61 pA
*   Is(Mvref2) = -6.61 pA
*   Id(Mnnot3) = 6.61 pA
*   Ib(Mnnot3) = -3.31 pA
*   Is(Mnnot3) = -3.3 pA
*   Id(M2) = 6.61 pA
*   Is(M2) = -6.61 pA
*   Id(M1) = 6.61 pA
*   Ib(M1) = -3.31 pA
*   Is(M1) = -3.3 pA
*   Id(Mnnot2) = 6.61 pA
*   Is(Mnnot2) = -6.61 pA
*   Id(Mvlk1) = 30.96 pA
*   Is(Mvlk1) = -30.96 pA
*   Id(Mvref1) = 6.61 pA
*   Is(Mvref1) = -6.61 pA
*   Id(Mnnot1) = 6.61 pA
*   Ib(Mnnot1) = -3.31 pA
*   Is(Mnnot1) = -3.3 pA
*   I(Csyn7) = 5.326 µA
*   I(Csyn6) = 5.326 µA
*   I(Csyn5) = 5.326 µA
*   I(Csyn3) = 5.326 µA
*   I(Csyn2) = 5.326 µA
*   I(Csyn1) = 5.326 µA
*   I(D112) = -190.8 nA
*   I(D111) = -190.8 nA
*   I(D110) = 389 nA
*   I(D109) = 389 nA
*   I(D108) = -190.8 nA
*   I(D107) = -190.8 nA
*   I(D106) = 389 nA
*   I(D105) = 389 nA
*   I(D104) = -190.8 nA
*   I(D103) = -190.8 nA
*   I(D102) = 389 nA
*   I(D101) = 389 nA
*   I(D100) = -190.8 nA
*   I(D99) = -190.8 nA
*   I(D98) = 389 nA
*   I(D97) = 389 nA
*   I(D96) = -190.8 nA
*   I(D95) = -190.8 nA
*   I(D94) = 389 nA
*   I(D93) = 389 nA
*   I(D92) = -190.8 nA
*   I(D91) = -190.8 nA
*   I(D90) = 389 nA
*   I(D89) = 389 nA
*   I(D88) = -190.8 nA
*   I(D87) = -190.8 nA
*   I(D86) = 389 nA
*   I(D85) = 389 nA
*   I(D84) = -190.8 nA
*   I(D83) = -190.8 nA
*   I(D82) = 389 nA
*   I(D81) = 389 nA
*   I(D80) = -190.8 nA
*   I(D79) = -190.8 nA
*   I(D78) = 389 nA
*   I(D77) = 389 nA
*   I(D76) = -190.8 nA
*   I(D75) = -190.8 nA
*   I(D74) = 389 nA
*   I(D73) = 389 nA
*   I(D72) = -190.8 nA
*   I(D71) = -190.8 nA
*   I(D70) = 389 nA
*   I(D69) = 389 nA
*   I(D68) = -190.8 nA
*   I(D67) = -190.8 nA
*   I(D66) = 389 nA
*   I(D65) = 389 nA
*   I(D48) = -190.8 nA
*   I(D47) = -190.8 nA
*   I(D46) = 389 nA
*   I(D45) = 389 nA
*   I(D44) = -190.8 nA
*   I(D43) = -190.8 nA
*   I(D42) = 389 nA
*   I(D41) = 389 nA
*   I(D40) = -190.8 nA
*   I(D39) = -190.8 nA
*   I(D38) = 389 nA
*   I(D37) = 389 nA
*   I(D36) = -190.8 nA
*   I(D35) = -190.8 nA
*   I(D34) = 389 nA
*   I(D33) = 389 nA
*   I(D32) = -190.8 nA
*   I(D31) = -190.8 nA
*   I(D30) = 389 nA
*   I(D29) = 389 nA
*   I(D28) = -190.8 nA
*   I(D27) = -190.8 nA
*   I(D26) = 389 nA
*   I(D25) = 389 nA
*   I(D24) = -190.8 nA
*   I(D23) = -190.8 nA
*   I(D22) = 389 nA
*   I(D21) = 389 nA
*   I(D20) = -190.8 nA
*   I(D19) = -190.8 nA
*   I(D18) = 389 nA
*   I(D17) = 389 nA
*   I(D16) = -190.8 nA
*   I(D15) = -190.8 nA
*   I(D14) = 389 nA
*   I(D13) = 389 nA
*   I(D12) = -190.8 nA
*   I(D11) = -190.8 nA
*   I(D10) = 389 nA
*   I(D9) = 389 nA
*   I(D8) = -190.8 nA
*   I(D7) = -190.8 nA
*   I(D6) = 389 nA
*   I(D5) = 389 nA
*   I(D4) = -190.8 nA
*   I(D3) = -190.8 nA
*   I(D2) = 389 nA
*   I(D1) = 389 nA
*   I(R5) = 666.7 nA
*   I(R4) = 666.7 nA
*   I(R3) = 666.7 nA
*   I(R2) = 666.7 nA
*   I(R1) = 666.7 nA
*   I(R368) = -5.709 pA
*   I(R367) = -5.709 pA
*   I(R307) = -2.95 µA
*   I(R306) = -2.95 µA
*   I(R305) = -2.243 µA
*   I(R304) = -2.833 µA
*   I(R303) = -2.243 µA
*   I(R302) = -2.833 µA
*   I(R301) = -5.076 µA
*   I(R300) = 5.076 µA
*   I(R299) = 325.8 nA
*   I(R298) = 6.562 µA
*   I(R297) = 325.8 nA
*   I(R296) = 6.562 µA
*   I(R293) = -4.61 pA
*   I(R292) = -4.61 pA
*   I(R290) = -2.95 µA
*   I(R289) = -2.95 µA
*   I(R288) = -2.243 µA
*   I(R287) = -2.833 µA
*   I(R286) = -2.243 µA
*   I(R285) = -2.833 µA
*   I(R284) = -5.076 µA
*   I(R283) = 5.076 µA
*   I(R282) = 325.8 nA
*   I(R281) = 6.562 µA
*   I(R280) = 325.8 nA
*   I(R279) = 6.562 µA
*   I(R278) = 413.1 pA
*   I(R277) = 413.1 pA
*   I(R276) = 413.2 pA
*   I(R275) = 413.2 pA
*   I(R274) = -4.656 pA
*   I(R273) = -4.656 pA
*   I(R271) = -4.656 pA
*   I(R270) = -4.656 pA
*   I(R265) = -2.95 µA
*   I(R264) = -2.95 µA
*   I(R263) = -2.243 µA
*   I(R262) = -2.833 µA
*   I(R261) = -2.243 µA
*   I(R260) = -2.833 µA
*   I(R259) = -5.076 µA
*   I(R258) = 5.076 µA
*   I(R257) = 325.8 nA
*   I(R256) = 6.562 µA
*   I(R255) = 325.8 nA
*   I(R254) = 6.562 µA
*   I(R251) = -4.61 pA
*   I(R250) = -4.61 pA
*   I(R248) = -2.95 µA
*   I(R247) = -2.95 µA
*   I(R246) = -2.243 µA
*   I(R245) = -2.833 µA
*   I(R244) = -2.243 µA
*   I(R243) = -2.833 µA
*   I(R242) = -5.076 µA
*   I(R241) = 5.076 µA
*   I(R240) = 325.8 nA
*   I(R239) = 6.562 µA
*   I(R238) = 325.8 nA
*   I(R237) = 6.562 µA
*   I(R236) = 413.1 pA
*   I(R235) = 413.1 pA
*   I(R234) = 413.2 pA
*   I(R233) = 413.2 pA
*   I(R232) = -4.656 pA
*   I(R231) = -4.656 pA
*   I(R229) = -4.656 pA
*   I(R228) = -4.656 pA
*   I(R223) = -2.95 µA
*   I(R222) = -2.95 µA
*   I(R221) = -2.243 µA
*   I(R220) = -2.833 µA
*   I(R219) = -2.243 µA
*   I(R218) = -2.833 µA
*   I(R217) = -5.076 µA
*   I(R216) = 5.076 µA
*   I(R215) = 325.8 nA
*   I(R214) = 6.562 µA
*   I(R213) = 325.8 nA
*   I(R212) = 6.562 µA
*   I(R209) = -4.61 pA
*   I(R208) = -4.61 pA
*   I(R206) = -2.95 µA
*   I(R205) = -2.95 µA
*   I(R204) = -2.243 µA
*   I(R203) = -2.833 µA
*   I(R202) = -2.243 µA
*   I(R201) = -2.833 µA
*   I(R200) = -5.076 µA
*   I(R199) = 5.076 µA
*   I(R198) = 325.8 nA
*   I(R197) = 6.562 µA
*   I(R196) = 325.8 nA
*   I(R195) = 6.562 µA
*   I(R194) = 413.1 pA
*   I(R193) = 413.1 pA
*   I(R192) = 413.2 pA
*   I(R191) = 413.2 pA
*   I(R190) = -4.656 pA
*   I(R189) = -4.656 pA
*   I(R187) = -4.656 pA
*   I(R186) = -4.656 pA
*   I(R139) = -2.95 µA
*   I(R138) = -2.95 µA
*   I(R137) = -2.243 µA
*   I(R136) = -2.833 µA
*   I(R135) = -2.243 µA
*   I(R134) = -2.833 µA
*   I(R133) = -5.076 µA
*   I(R132) = 5.076 µA
*   I(R131) = 325.8 nA
*   I(R130) = 6.562 µA
*   I(R129) = 325.8 nA
*   I(R128) = 6.562 µA
*   I(R125) = -4.61 pA
*   I(R124) = -4.61 pA
*   I(R122) = -2.95 µA
*   I(R121) = -2.95 µA
*   I(R120) = -2.243 µA
*   I(R119) = -2.833 µA
*   I(R118) = -2.243 µA
*   I(R117) = -2.833 µA
*   I(R116) = -5.076 µA
*   I(R115) = 5.076 µA
*   I(R114) = 325.8 nA
*   I(R113) = 6.562 µA
*   I(R112) = 325.8 nA
*   I(R111) = 6.562 µA
*   I(R110) = 413.1 pA
*   I(R109) = 413.1 pA
*   I(R108) = 413.2 pA
*   I(R107) = 413.2 pA
*   I(R106) = -4.656 pA
*   I(R105) = -4.656 pA
*   I(R103) = -4.656 pA
*   I(R102) = -4.656 pA
*   I(R97) = -2.95 µA
*   I(R96) = -2.95 µA
*   I(R95) = -2.243 µA
*   I(R94) = -2.833 µA
*   I(R93) = -2.243 µA
*   I(R92) = -2.833 µA
*   I(R91) = -5.076 µA
*   I(R90) = 5.076 µA
*   I(R89) = 325.8 nA
*   I(R88) = 6.562 µA
*   I(R87) = 325.8 nA
*   I(R86) = 6.562 µA
*   I(R83) = -4.61 pA
*   I(R82) = -4.61 pA
*   I(R80) = -2.95 µA
*   I(R79) = -2.95 µA
*   I(R78) = -2.243 µA
*   I(R77) = -2.833 µA
*   I(R76) = -2.243 µA
*   I(R75) = -2.833 µA
*   I(R74) = -5.076 µA
*   I(R73) = 5.076 µA
*   I(R72) = 325.8 nA
*   I(R71) = 6.562 µA
*   I(R70) = 325.8 nA
*   I(R69) = 6.562 µA
*   I(R68) = 413.1 pA
*   I(R67) = 413.1 pA
*   I(R66) = 413.2 pA
*   I(R65) = 413.2 pA
*   I(R64) = -4.656 pA
*   I(R63) = -4.656 pA
*   I(R61) = -4.656 pA
*   I(R60) = -4.656 pA
*   I(R55) = -2.95 µA
*   I(R54) = -2.95 µA
*   I(R53) = -2.243 µA
*   I(R52) = -2.833 µA
*   I(R51) = -2.243 µA
*   I(R50) = -2.833 µA
*   I(R49) = -5.076 µA
*   I(R48) = 5.076 µA
*   I(R47) = 325.8 nA
*   I(R46) = 6.562 µA
*   I(R45) = 325.8 nA
*   I(R44) = 6.562 µA
*   I(R41) = -4.61 pA
*   I(R40) = -4.61 pA
*   I(R38) = -2.95 µA
*   I(R37) = -2.95 µA
*   I(R36) = -2.243 µA
*   I(R35) = -2.833 µA
*   I(R34) = -2.243 µA
*   I(R33) = -2.833 µA
*   I(R32) = -5.076 µA
*   I(R31) = 5.076 µA
*   I(R30) = 325.8 nA
*   I(R29) = 6.562 µA
*   I(R28) = 325.8 nA
*   I(R27) = 6.562 µA
*   I(R26) = 413.1 pA
*   I(R25) = 413.1 pA
*   I(R24) = 413.2 pA
*   I(R23) = 413.2 pA
*   I(R22) = -4.656 pA
*   I(R9) = -4.656 pA
*   I(R7) = -4.656 pA
*   I(R6) = -4.656 pA
*   I(R356) = -5.709 pA
*   I(R355) = -5.709 pA
*   I(R354) = -5.709 pA
*   I(R21) = 1 mA
*   I(R20) = 1 mA
*   I(R19) = -1 mA
*   I(R18) = 1.43 nA
*   I(R17) = -1 mA
*   I(R16) = 1 mA
*   I(R15) = 1 mA
*   I(R14) = -1 mA
*   I(R13) = 1.43 nA
*   I(R12) = -1 mA
*   I(V3) = -666.7 nA
*   I(Vdd2) = 68.74 µA
*   I(Voff1) = -2 mA
*   I(V2) = -219.7 mA
*   I(V1) = 221.8 mA
*   I(Vdd1) = -189.4 µA